# EAGLE design RunnersHighEA_main (EAGLE 9.5.0)
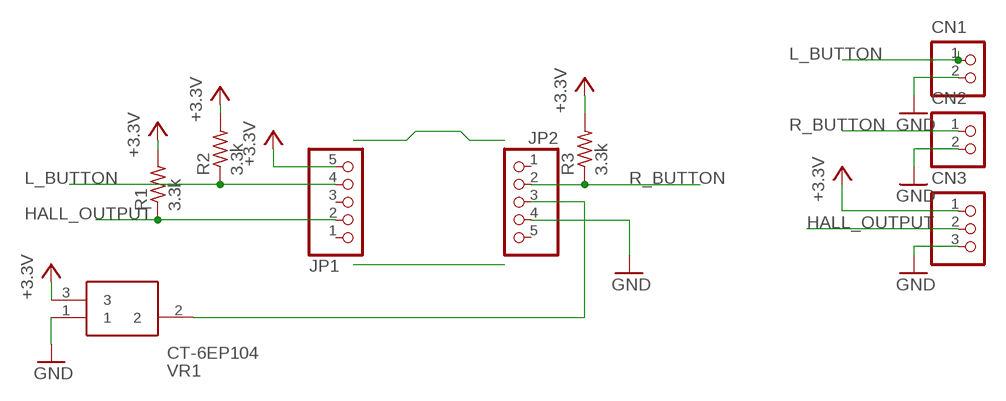
[diagram p0: schematic, sheet 1]

## Parts
CN1  S2B-PH-SM4-TB  [S2B-PH-SM4-TB]
CN2  S2B-PH-SM4-TB  [S2B-PH-SM4-TB]
CN3  S3B-PH-SM4-TB  [S3B-PH-SM4-TB]
JP1  PINHD-1X5  [1X05]
JP2  PINHD-1X5  [1X05]
R1  3.3k  R-US_R0603  [R0603]
R2  3.3k  R-US_R0603  [R0603]
R3  3.3k  R-US_R0603  [R0603]
VR1  CT-6EP104  [CT-6EP]

## Nets
+3.3V: CN3.1 JP1.5 R1.2 R2.2 R3.2 VR1.3
GND: CN1.2 CN2.2 CN3.3 JP2.4 VR1.1
HALL_OUTPUT: CN3.2 JP1.2 R1.1
L_BUTTON: CN1.1 JP1.4 R2.1
N$1: JP2.3 VR1.2
R_BUTTON: CN2.1 JP2.2 R3.1
Unconnected: JP1.1 JP1.3 JP2.1 JP2.5

## Library data of the parts
CN1 CN2 = jst-ph:S2B-PH-*: Wire-to-Board 2.0mm pitch side mount connector Source: http://www.jst-mfg.com/product/pdf/jpn/PH.pdf http://www.jst-mfg.com/product/detail.php?series=199
CN3 = jst-ph:S3B-PH-*: Wire-to-Board 2.0mm pitch side mount connector Source: http://www.jst-mfg.com/product/pdf/jpn/PH.pdf http://www.jst-mfg.com/product/detail.php?series=199
JP1 JP2 = pinheader:PINHD-1X5
R1-R3 = rcl:R-US_: RESISTOR, American symbol; SPICEPREFIX: R
VR1 = SamacSys_Parts:CT-6EP104: NIDEC COPAL ELECTRONICS - CT-6EP104 - TRIMMER POT, CERMET, 100K, 1TURN, TH Source: Datasheet <http://www.farnell.com/datasheets/2608184.pdf>; DESCRIPTION: NIDEC COPAL ELECTRONICS - CT-6EP104 - TRIMMER POT, CERMET, 100K, 1TURN, TH; HEIGHT: mm; MANUFACTURER_NAME: Copal Electronics; MANUFACTURER_PART_NUMBER: CT-6EP104

## Board
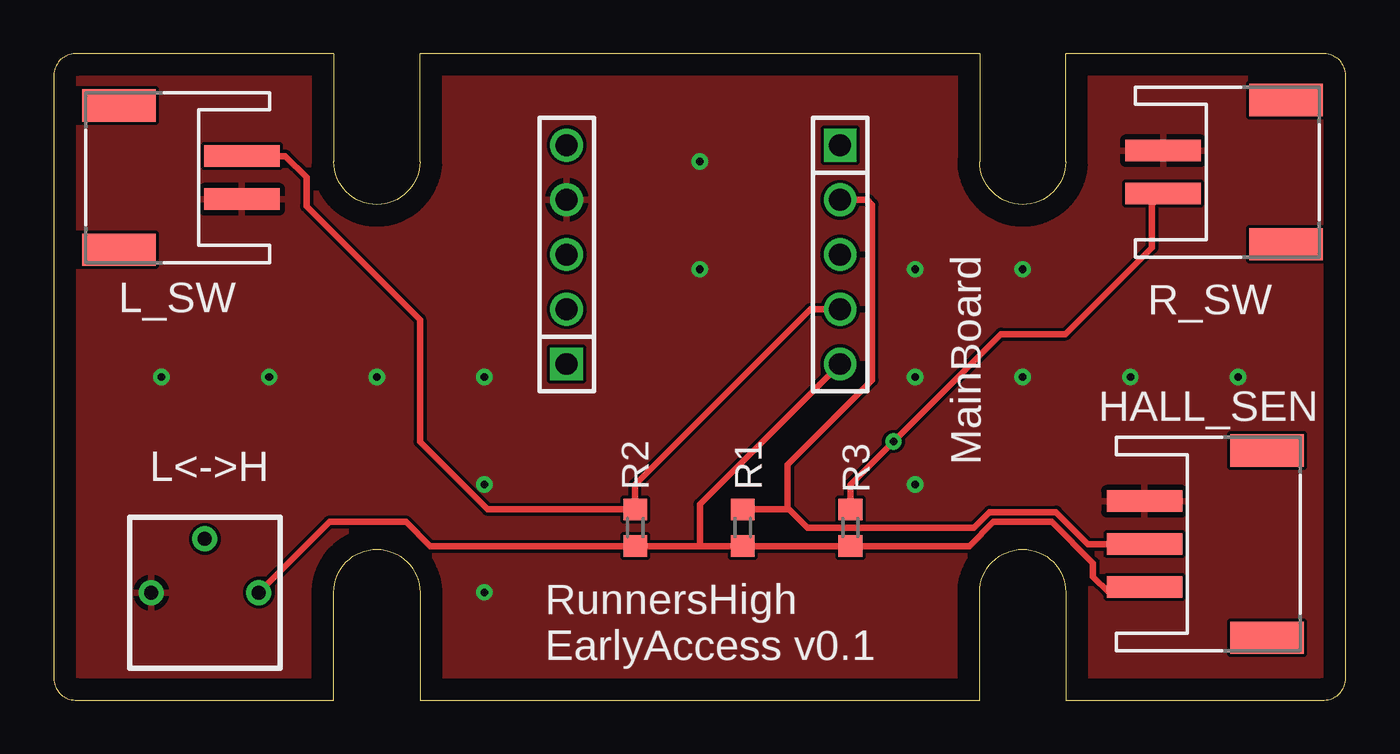
[diagram p1: board, top side]
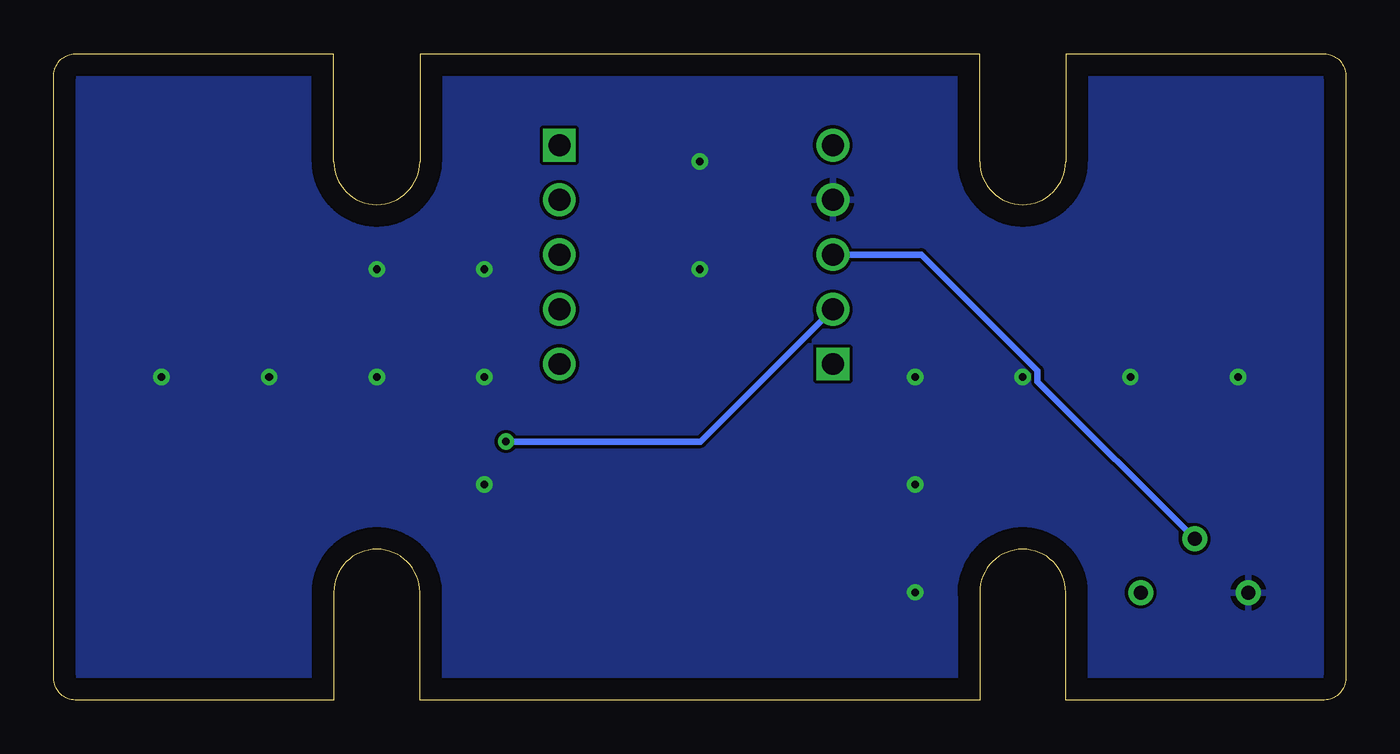
[diagram p2: board, bottom side, seen from below]

Size 60 x 30 mm. Coordinates in mm from the lower left corner, seen from the top.
Outline: 0,29 0,1 arc90 1,0 13,0 13,5 arc-180 17,5 17,0 43,0 43,5 arc-180 47,5 47,0 59,0 arc90 60,1 60,29 arc90 59,30 47,30 47,25 arc-180 43,25 43,30 17,30 17,25 arc-180 13,25 13,30 1,30 arc90 0,29
Copper layers (1*16): Top 0.035mm / dielectric 1.5mm / Bottom 0.035mm
Design rules "default": minimum track width 6mil, minimum drill 0.35mm, track to track 6mil, track to pad 6mil, pad to pad 6mil, via to via 6mil, smd to smd 6mil, copper to edge 40mil, drill to drill 6mil, minimum pad ring 10mil, minimum via ring 8mil, stop-mask expansion 4mil, vias tented up to drill 0mil, thermal gap 10mil

### Footprints (pad centres in the part's own frame; a part is rotated, then mirrored left to right if it is on the bottom)
S2B-PH-SM4-TB = smd 1 x 3.5: 1 1,-1; 2 -1,-1 | smd 1.5 x 3.4: S1 -3.35,4.7; S2 3.35,4.7
S3B-PH-SM4-TB = smd 1 x 3.5: 1 2,-1; 2 0,-1; 3 -2,-1 | smd 1.5 x 3.4: S1 -4.35,4.7; S2 4.35,4.7
1X05 = drill 1.016 square: 1 -5.08,0 | drill 1.016: 2 -2.54,0; 3 0,0; 4 2.54,0; 5 5.08,0
R0603 = smd 1 x 1.1: 1 -0.85,0; 2 0.85,0
CT-6EP = drill 0.65 pad 1.15: 1 -2.5,0; 2 0,2.5; 3 2.5,0

### Placement (x,y rotation side)
CN1  7.73,24.25 90 top
CN2  52.52,24.51 270 top
CN3  51.65,7.24 270 top
JP1  36.52,20.68 270 top
JP2  23.82,20.68 90 top
R1  32,8 270 top
R2  27,8 270 top
R3  37,8 270 top
VR1  7.02,4.98 0 top

### Tracks (layer width: path | path; a pad name or v marks a point on that pad's centre or on a via)
+3.3V
  Top 0.305: 30,7.15 R2.2 17.47,7.15 16.35,8.27 12.8,8.27 VR1.3 | 30,7.15 R1.2 R3.2 42.53,7.15 43.65,8.27 46.35,8.27 48.27,6.35 48.27,5.73 49,5 50.41,5 CN3.1 | JP1.5 30,9.08 30,7.15
GND  (via drill 0.35)
  other vias: 5,15 10,15 20,15 20,10 15,15 30,25 30,20 40,15 40,20 45,20 45,15 40,10 50,15 55,15 20,5
  pour Top: 0,30 0,0 60,0 60,30
  pour Bottom: 0,30 0,0 60,0 60,30
HALL_OUTPUT
  Top 0.305: R1.1 34,8.85 | 34,8.85 34.15,8.85 35,8 42.73,8 43.46,8.73 46.54,8.73 48.03,7.24 CN3.2 | JP1.2 37.78,23.22 38,23 38,14.85 34.08,10.93 34.08,8.93 34,8.85
L_BUTTON
  Top 0.305: CN1.1 10.75,25.25 11.73,24.27 11.73,22.93 17,17.66 17,12 20.15,8.85 R2.1 27,10 35.14,18.14 JP1.4
N$1
  Bottom 0.305: VR1.2 14.32,14.79 14.32,15.28 19.71,20.68 JP2.3
R_BUTTON  (via drill 0.35)
  Top 0.305: CN2.1 51,22.98 51,21 46.99,16.99 43.99,16.99 v39,12 37,10 R3.1
  Bottom 0.305: v39,12 29.96,12 JP2.2

### Text on the board
tPlace: L_SW | R_SW | HALL_SEN | MainBoard | L<->H | RunnersHigh / EarlyAccess v0.1